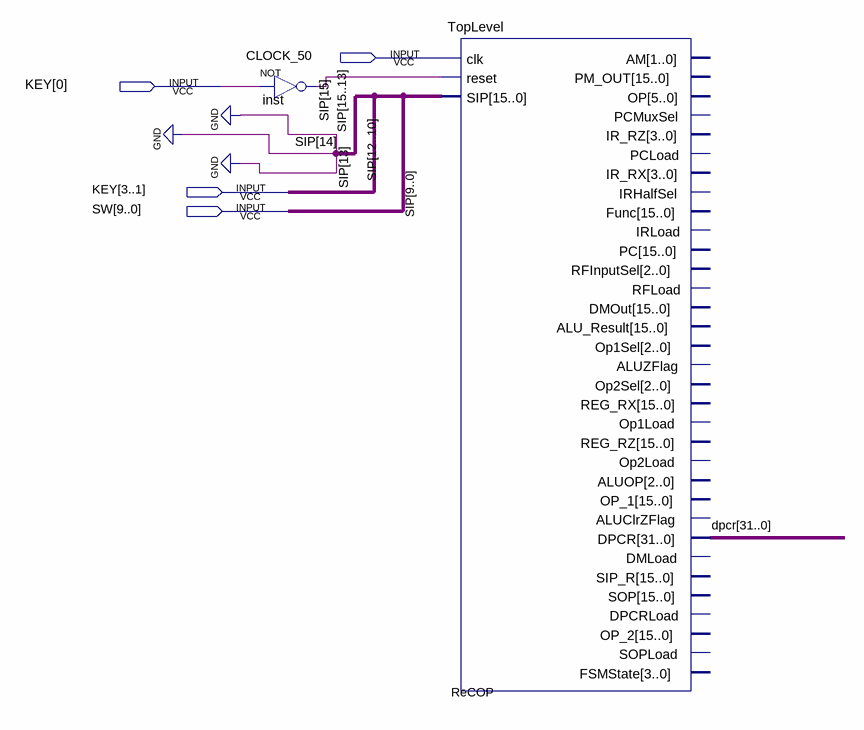
[diagram p0: schematic sheet]
// Quartus schematic ReCOP.bdf as structural Verilog: 2 symbols, 4 pins
module ReCOP (
  input  CLOCK_50,
  input  [3:0] KEY,
  input  [9:0] SW
);

  wire inst_out;
  wire [31:0] dpcr;

  not inst (inst_out, KEY[0]);
  TopLevel ReCOP (
    .clk(CLOCK_50), .reset(inst_out), .SIP({3'b000, KEY[3:1], SW}), .DPCR(dpcr));  // open: AM, PM_OUT, OP, PCMuxSel, IR_RZ, PCLoad, IR_RX, IRHalfSel, Func, IRLoad, PC, RFInputSel, RFLoad, DMOut, ALU_Result, Op1Sel, ALUZFlag, Op2Sel, REG_RX, Op1Load, REG_RZ, Op2Load, ALUOP, OP_1, ALUClrZFlag, DMLoad, SIP_R, SOP, DPCRLoad, OP_2, SOPLoad, FSMState

  // Other names for the same wires on the sheet: SIP[12:0] = {KEY[3:1], SW}
endmodule
